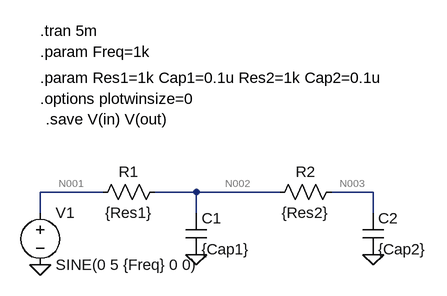
[diagram p0: schematic Project_2nd_LPF_TRAN.asc]
Project_2nd_LPF_TRAN.asc, the LTspice schematic file:
Version 4
SHEET 1 880 680
WIRE 176 96 80 96
WIRE 320 96 256 96
WIRE 448 96 320 96
WIRE 592 96 528 96
WIRE 80 128 80 96
WIRE 320 128 320 96
WIRE 592 128 592 96
FLAG 80 208 0
FLAG 320 192 0
FLAG 592 192 0
SYMBOL voltage 80 112 R0
WINDOW 123 0 0 Left 0
WINDOW 39 0 0 Left 0
SYMATTR InstName V1
SYMATTR Value SINE(0 5 {Freq} 0 0)
SYMBOL cap 304 128 R0
SYMATTR InstName C1
SYMATTR Value {Cap1}
SYMBOL cap 576 128 R0
SYMATTR InstName C2
SYMATTR Value {Cap2}
SYMBOL res 272 80 R90
WINDOW 0 0 56 VBottom 2
WINDOW 3 32 56 VTop 2
SYMATTR InstName R1
SYMATTR Value {Res1}
SYMBOL res 544 80 R90
WINDOW 0 0 56 VBottom 2
WINDOW 3 32 56 VTop 2
SYMATTR InstName R2
SYMATTR Value {Res2}
TEXT 80 -152 Left 2 !.tran 5m
TEXT 80 -120 Left 2 !.param Freq=1k
TEXT 80 -80 Left 2 !.param Res1=1k Cap1=0.1u Res2=1k Cap2=0.1u
TEXT 80 -48 Left 2 !.options plotwinsize=0
TEXT 88 -16 Left 2 !.save V(in) V(out)

The netlist it stands for:
* Project_2nd_LPF_TRAN.asc
V1 N001 0 SINE(0 5 {Freq} 0 0)
C1 N002 0 {Cap1}
C2 N003 0 {Cap2}
R1 N002 N001 {Res1}
R2 N003 N002 {Res2}
.tran 5m
.param Freq=1k
.param Res1=1k Cap1=0.1u Res2=1k Cap2=0.1u
.options plotwinsize=0
.save V(in) V(out)
.backanno
.end

* Results of the author's LTspice run, read from the files saved beside the schematic
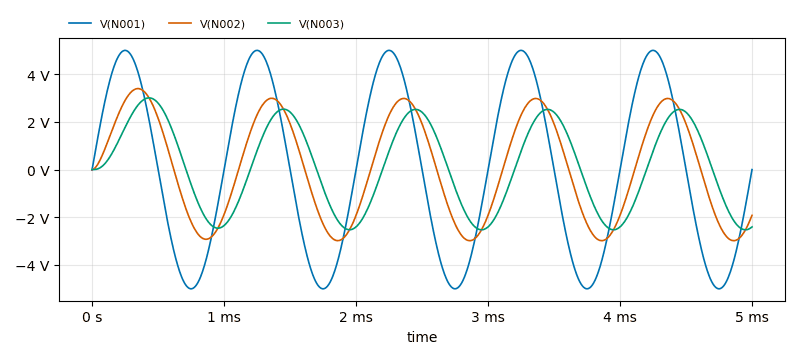
[diagram p1: Transient Analysis of Project_2nd_LPF_TRAN.asc, plotted from the saved traces]
* Transient Analysis, 1 run:
*   V(N001): min -5 V, max 5 V, average 0 V, rms 3.536 V, last 0 V
*   V(N002): min -2.982 V, max 3.397 V, average 86.49 mV, rms 2.144 V, last -1.92 V
*   V(N003): min -2.525 V, max 3.007 V, average 134.6 mV, rms 1.811 V, last -2.405 V